# Altium schematic sheet Sheet3.SchDoc
size A4; SheetNumber: 3; SheetTotal: 6
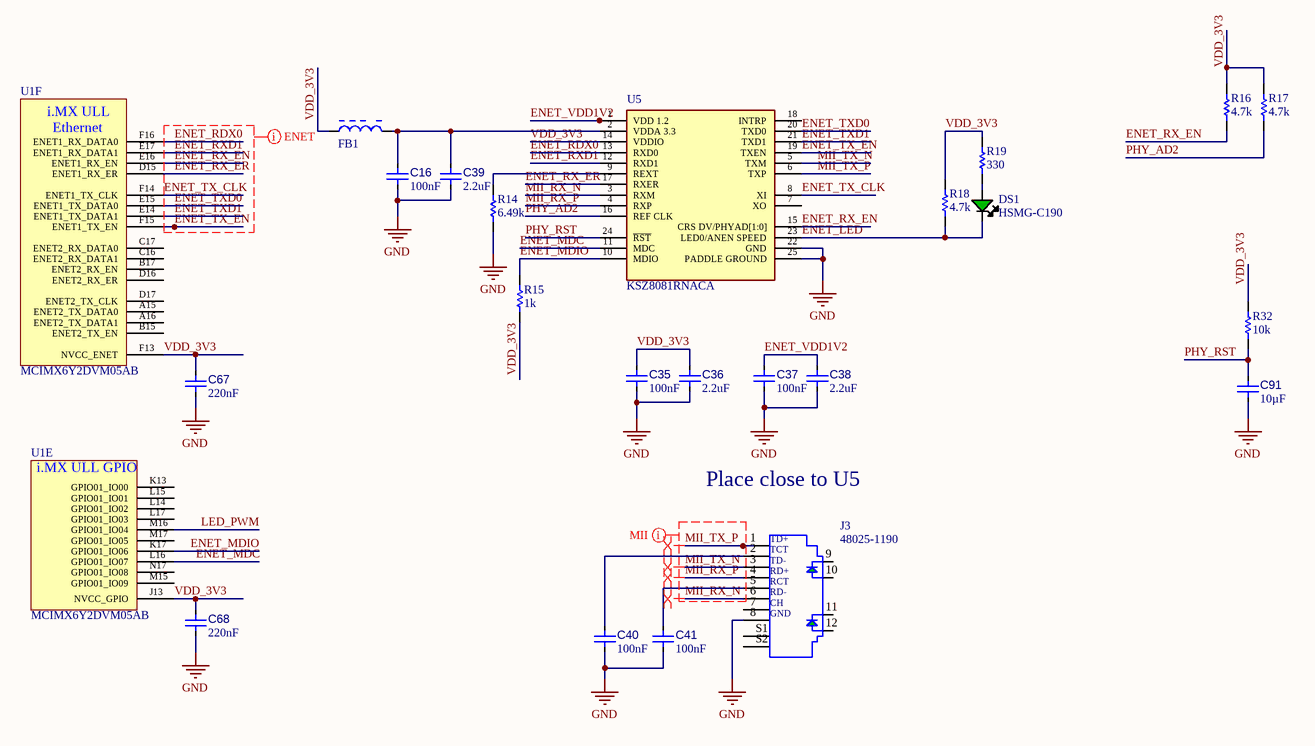
[diagram p0: Sheet3.SchDoc]

## Parts
C16  value 100nF  [0402-SMD-CAP]  (hidden comment: EMF105B7104MVHF)
C35  value 100nF  [0402-SMD-CAP]  (hidden comment: EMF105B7104MVHF)
C36  value 2.2uF  [0603-SMD-CAP]  (hidden comment: GRM188R71A225KE15D)
C37  value 100nF  [0402-SMD-CAP]  (hidden comment: EMF105B7104MVHF)
C38  value 2.2uF  [0603-SMD-CAP]  (hidden comment: GRM188R71A225KE15D)
C39  value 2.2uF  [0603-SMD-CAP]  (hidden comment: GRM188R71A225KE15D)
C40  value 100nF  [0402-SMD-CAP]  (hidden comment: EMF105B7104MVHF)
C41  value 100nF  [0402-SMD-CAP]  (hidden comment: EMF105B7104MVHF)
C67  value 220nF  [0402-SMD-CAP]  (hidden comment: GRM155R71C224KA12D)
C68  value 220nF  [0402-SMD-CAP]  (hidden comment: GRM155R71C224KA12D)
C91  value 10µF  [0603-SMD-CAP]  (hidden comment: 0603ZD106KAT2A)
DS1  HSMG-C190  [AVAG-HSMX-C190_V]
FB1  BLM21BB221SN1D  [MURA-BLM21-H1-CHIP-2_V]  (value not drawn)
J3  48025-1190  [MOLX-48025-1190_V]
R14  value 6.49k  [0402_SMD_RES]  (hidden comment: CRCW04026K49FKED)
R15  value 1k  [0402_SMD_RES]  (hidden comment: ERJ-2RKF1001X)
R16  value 4.7k  [0402_SMD_RES]  (hidden comment: RC0402FR-074K7L)
R17  value 4.7k  [0402_SMD_RES]  (hidden comment: RC0402FR-074K7L)
R18  value 4.7k  [0402_SMD_RES]  (hidden comment: RC0402FR-074K7L)
R19  value 330  [0402_SMD_RES]  (hidden comment: CRCW0402330RJNTD)
R32  value 10k  [0402_SMD_RES]  (hidden comment: CRCW040210K0FKTD)
U1  MCIMX6Y2DVM05AB  [BGA100P9X9-81A]  (parts E,F of 11)
U5  KSZ8081RNACA  [FP-QFN44-24LD-PL-1-IPC_C]

## Nets
GND: C16.1 C35.1 C36.1 C37.1 C38.1 C39.1 C40.1 C41.1 C67.2 C68.2 C91.2 J3.8(GND) R14.1 U5.22(GND) U5.25(PADDLE_GROUND)
ENET_LED: DS1.2(K) R18.1 U5.23(LED0/ANEN_SPEED)
ENET_MDC: U1.L16(GPIO01_IO07) U5.11(MDC)
ENET_MDIO: R15.2 U1.K17(GPIO01_IO06) U5.10(MDIO)
ENET_RDX0: U1.F16(ENET1_RX_DATA0) U5.13(RXD0)
ENET_RX_EN: R16.1 U1.E16(ENET1_RX_EN) U5.15(CRS_DV/PHYAD[1:0])
ENET_RX_ER: U1.D15(ENET1_RX_ER) U5.17(RXER)
ENET_RXD1: U1.E17(ENET1_RX_DATA1) U5.12(RXD1)
ENET_TX_CLK: U1.F14(ENET1_TX_CLK) U5.8(XI)
ENET_TX_EN: U1.F15(ENET1_TX_EN) U5.19(TXEN)
ENET_TXD0: U1.E15(ENET1_TX_DATA0) U5.20(TXD0)
ENET_TXD1: U1.E14(ENET1_TX_DATA1) U5.21(TXD1)
ENET_VDD1V2: C37.2 C38.2 U5.1(VDD_1.2)
LED_PWM: U1.M16(GPIO01_IO04)
MII_RX_N: J3.6(RD-) U5.3(RXM)
MII_RX_P: J3.4(RD+) U5.4(RXP)
MII_TX_N: J3.3(TD-) U5.5(TXM)
MII_TX_P: J3.1(TD+) U5.6(TXP)
PHY_AD2: R17.1 U5.16(REF_CLK)
PHY_RST: C91.1 R32.1 U5.24(~{RST})
VDD_3V3: C35.2 C36.2 C67.1 C68.1 FB1.1 R15.1 R16.2 R17.2 R18.2 R19.2 R32.2 U1.F13(NVCC_ENET) U1.J13(NVCC_GPIO) U5.14(VDDIO)
NetC16_2: C16.2 C39.2 FB1.2 U5.2(VDDA_3.3)
NetC40_2: C40.2 J3.2(TCT)
NetC41_2: C41.2 J3.5(RCT)
NetDS1_1: DS1.1(A) R19.1
NetR14_2: R14.2 U5.9(REXT)

Not connected (* = marked no-connect by the designer): J3 7(CHASSIS) 9 10 11 12 S1 S2; U1 A15(ENET2_TX_DATA0) A16(ENET2_TX_DATA1) B15(ENET2_TX_EN) B17(ENET2_RX_EN) C16(ENET2_RX_DATA1) C17(ENET2_RX_DATA0) D16(ENET2_RX_ER) D17(ENET2_TX_CLK) K13(GPIO01_IO00) L14(GPIO01_IO02) L15(GPIO01_IO01) L17(GPIO01_IO03) M15(GPIO01_IO09) M17(GPIO01_IO05) N17(GPIO01_IO08); U5 7(XO) 18(INTRP)

## Layout directives
net class ENET: ENET_RDX0, ENET_RX_EN, ENET_RX_ER, ENET_RXD1, ENET_TX_CLK, ENET_TX_EN, ENET_TXD0, ENET_TXD1
differential pair: MII_RX_N, MII_RX_P, MII_TX_N, MII_TX_P
net class MII: MII_RX_N, MII_RX_P, MII_TX_N, MII_TX_P

## Notes on the sheet
- Place close to U5
- (in symbol CMP-002-00000-4) CH
- (in symbol CMP-003-000001-14, part E) i.MX ULL GPIO
- (in symbol CMP-003-000001-14, part F) i.MX ULL; Ethernet

## Library data of the parts
C16 C35 C37 C40 C41 = CMP-001-00001-14: Chip Capacitor, 0.1 uF, +/- 5%, 16 V, 0402 (1005 Metric); Capacitor Type: Ceramic; Voltage Rating: 16V; Case/Package: 0402; Max Operating Temperature: 125°C; Mounting Technology: SM; RoHS Compliant: True; Pins: 2; Min Operating Temperature: -55°C; Tolerance: 5%; Mfr. Part No.: EMF105B7104MVHF
C36 C38 C39 = CMP-001-00083-8: CAP CER 2.2UF 10V X7R 0603; Tolerance: 10%; Material: Ceramic; Height: 0.8mm; Capacitance: 2.2uF; Case Code (Imperial): 0603; Termination: Standard; Voltage Rating (DC): 10V; Voltage: 10V; RoHS Compliant: Yes; Length: 1.6mm; Thickness: 0.035inch; Case Code (Metric): 1608; REACH SVHC: No SVHC; Package Quantity: 4000; Case/Package: 0603; Mount: Surface Mount; Depth: 0.8mm; Packaging: Cut Tape; Lead Free: Lead Free; Series: GRM; Width: 0.8mm; Dielectric: X7R; Number of Pins: 2; Weight: 0.000222oz; Max Operating Temperature: 125°C; Voltage Rating: 10V; Min Operating Temperature: -55°C
C67 C68 = CMP-001-00090-10: MURATA - GRM155R71C224KA12D - SMD Multilayer Ceramic Capacitor, 0.22 µF, 16 V, 0402 [1005 Metric], ± 10%, X7R, GRM Series; Voltage: 16V; Package Quantity: 1; Height: 0.5mm; Tolerance: 10%; Case/Package: 0402; Case Code (Metric): 1005; Packaging: Tape and Reel; Min Operating Temperature: -55°C; Mount: Surface Mount; RoHS Compliant: Yes; Thickness: 0.022inch; Depth: 0.5mm; Lead Free: Lead Free; Series: GRM; REACH SVHC: No SVHC; Width: 0.02inch; Voltage Rating: 16V; Material: Ceramic; Radiation Hardening: No; Voltage Rating (DC): 16V; Capacitance: 220nF; Max Operating Temperature: 125°C; Length: 1mm; Construction: Flat; Dielectric: X7R; Termination: SMD/SMT; Case Code (Imperial): 0402
C91 = CMP-001-00075-11: Chip Capacitor, 10µF +/-20%, 10V, 0603, Thickness 1 mm; Tolerance: 10%; Pins: 2; Case/Package: 0603; Mounting Technology: SMT; Max Operating Temperature: 85°C; Min Operating Temperature: -55°C; Voltage Rating: 10V; Mfr. Part No.: 0603ZD106KAT2A
DS1 = CMP-007-00013-5: LED Uni-Color Green, 52 mW, 20 mA, -40 to 85 degC, 2-Pin SMD, RoHS, Tape and Reel; Manufacturer: Avago; Power: 52mW; Forward Voltage: 2.2V; Lens Style: Diffused; Viewing Angle: 170degrees; Luminous Intensity: 15mcd; Forward Current: 20mA; Colour: Green; Pins: 2; Min Operating Temperature: -40°C; Packaging: TapeandReel; Package Quantity: 4000; Manufacturer URL: http://www.avagotech.com/; Case/Package: 0603; RoHS Compliant: True; Datasheet Version: Mar-12; Datasheet URL: http://docs.avagotech.com/docs/AV02-0551EN; Mounting Technology: SM; Package Description: 2-Pin Surface Mount Device, Body 1.6 x 0.8 mm, Height 0.9 mm; Package Reference: HSMX-C190; Illumination Colour: Green; Nominal Vf: 2.2V; Max Operating Temperature: 85°C
FB1 = CMP-006-00021-8: FERRITE CHIP 220 OHM 0805; Current Rating: 500mA; Tolerance: 25%; Test Frequency: 100MHz; Number of Circuits: 1; DC Resistance-Max: 260mR; Material: Ferrite,Steel; Impedance: 220R; Resistance: 350mR; Max DC Current: 200mA; Shielding: Unshielded; Depth: 1.25mm; Max Current Rating: 500mA; Case Code (Imperial): 0805; Case/Package: 0805; Max Operating Temperature: 125°C; Package Quantity: 4000; Width: 1.25mm; Height: 0.85mm; Number of Pins: 2; Min Operating Temperature: -55°C; Termination: SMD/SMT; Length: 2mm; Number of Lines: 1; DC Resistance (DCR): 260mR; Case Code (Metric): 2012; Lead Free: Lead Free; RoHS Compliant: Yes; REACH SVHC: No SVHC; Packaging: Tape and Reel; Series: BLM21B; Core Material: Ferrite
J3 = CMP-002-00000-4: Modular Jack with Integrated Magnetics with LED, 1.5 A, -40 to 70 degC, 12-Pin THD, RoHS, Tray; Manufacturer: Molex; Max Voltage Rating (AC): 150V; Capacitance: -45f; Shielding: Shielded; Current Rating: 1.5A; Gender: Female; Manufacturer URL: http://www.molex.com/; Pins: 8; RoHS Compliant: True; Connector Type: Modular; Lead Pitch: 1.27mm; Housing Material: Nylon; Voltage Rating: 150V; Package Reference: 48025-1190; Contact Material: Brass; Datasheet Version: Rev. G, 01/2012; Max Operating Temperature: 70°C; Package Quantity: 1080; Case/Package: 48025-1190; Mounting Technology: TH; Min Operating Temperature: -40°C; Package Description: 12-Pin Through Hole Device, Body 16.2 x 25.4 mm; Datasheet URL: http://www.molex.com/pdm_docs/sd/480251190_sd.pdf; Packaging: Tray; Contact Plating: Gold
R14 = CMP-009-00182-7: Res Thick Film 0402 6.49K Ohm 1% 0.063W(1/16W) ±100ppm/C Pad SMD Automotive T/R; Voltage Rating: 50V; Temperature Coefficient: 100ppm/°C; Max Power Dissipation: 63mW; Resistance Tolerance: 1%; Width: 0.02inch; REACH SVHC: Unknown; Series: CRCW; Number of Terminations: 2; Max Operating Temperature: 155°C; Termination: SMD/SMT; Mount: Surface Mount; RoHS Compliant: Yes; Construction: Rectangular; Height: 0.35mm; Voltage Rating (DC): 50V; Radiation Hardening: No; Package Quantity: 10; Length: 1mm; Min Operating Temperature: -55°C; Case Code (Metric): 1005; Packaging: Tape and Reel; Lead Free: Lead Free; Contact Plating: Tin; Tolerance: 1%; Technology: THICK FILM; Military Standard: Not; Depth: 0.5mm; Resistance: 6.49k; Number of Pins: 2; Case/Package: 0402; Features: Automotive AEC-Q200; Resistor Type: Thick Film; Case Code (Imperial): 0402; Weight: 2.3E-05oz; Power Rating: 63mW
R15 = CMP-009-00009-12: Chip Resistor, 1 KOhm, +/- 1%, 0.1 W, -55 to 155 degC, 0402 (1005 Metric); Power: 100mW; Voltage Rating: 50V; RoHS Compliant: True; Case/Package: 0402; Mounting Technology: SM; Pins: 2; Max Operating Temperature: 155°C; Min Operating Temperature: -55°C; Tolerance: 1%; Mfr. Part No.: ERJ-2RKF1001X
R16-R18 = CMP-009-00034-11: Chip Resistor, 4.7 KOhm, +/- 1%, 63 mW, -55 to 155 degC, 0402 (1005 Metric); Voltage Rating: 50V; Power: 63mW; Tolerance: 1%; Pins: 2; Case/Package: 0402; Mounting Technology: SM; Min Operating Temperature: -55°C; Max Operating Temperature: 155°C; RoHS Compliant: True; Resistance: 4.7k; Mfr. Part No.: RC0402FR-074K7L
R19 = CMP-009-00132-9: Chip Resistor, 330 Ohms, +/-5 %, 63 mW, -55 to 155 degC, 0402; Power: 63mW; Tolerance: 5%; Case/Package: 0402; Pins: 2; Max Operating Temperature: 155°C; Min Operating Temperature: -55°C; Mfr. Part No.: CRCW0402330RJNTD
R32 = CMP-009-00149-9: Chip Resistor, 10 kOhms, +/-1 %, 63 mW, -55 to 125 degC, 0402; Power: 63mW; Tolerance: 1%; Pins: 2; Max Operating Temperature: 155°C; Min Operating Temperature: -55°C; Case/Package: 0402; Mfr. Part No.: CRCW040210K0FKTD
U1 = CMP-003-000001-14: Package: MAPBGA; Design Item ID: MCIMX6Y2DVM05AB; Mfr. Part Nr.: MCIMX6Y2DVM05AB; Source: Schlib1.SchLib
U5 = CMP-015-00008-8: MICROCHIP - KSZ8081RNACA - ETHERNET TRANSCEIVER, 100MBPS, QFN-24; Simplex/Duplex: Full Duplex; Min Operating Temperature: 0°C; Case/Package: QFN; Packaging: Rail/Tube; RoHS Compliant: Yes; Mount: Surface Mount; Max Operating Temperature: 70°C